# Altium schematic sheet ReadCard.SchDoc
size A4
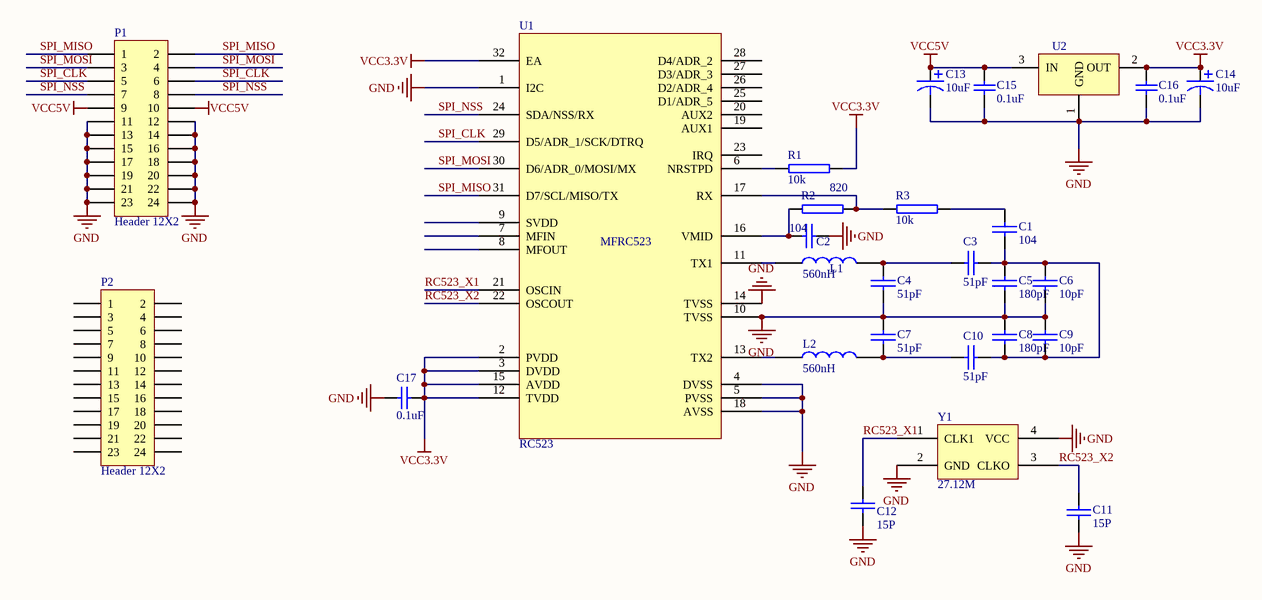
[diagram p0: ReadCard.SchDoc]

## Parts
C1  104  [0603C]
C2  104  [0603C]
C3  51pF  [0603C]
C4  51pF  [0603C]
C5  180pF  [0603C]
C6  10pF  [0603C]
C7  51pF  [0603C]
C8  180pF  [0603C]
C9  10pF  [0603C]
C10  51pF  [0603C]
C11  15P  [0603c]
C12  15P  [0603C]
C13  10uF  [1206_C]
C14  10uF  [1206_C]
C15  0.1uF  [0603_C]
C16  0.1uF  [0603_C]
C17  0.1uF  [0603_C]
L1  560nH  [0805r]
L2  560nH  [0805r]
P1  Header 12X2  [12x2_2.0mm]
P2  Header 12X2  [12x2_2.0mm]
R1  10k  [0603R]
R2  820  [0603R]
R3  10k  [0603R]
U1  RC523  [rc522]
U2  LM1117  [SOT-223]  (value not drawn)
Y1  27.12M  [27.12M_3225]

## Nets
GND: C2.1 C4.2 C5.2 C6.2 C7.1 C8.1 C9.1 C11.1 C12.1 C13.2 C14.2 C15.2 C16.2 C17.1 P1.11 P1.12 P1.13 P1.14 P1.15 P1.16 P1.17 P1.18 P1.19 P1.20 P1.21 P1.22 P1.23 P1.24 U1.1(I2C) U1.4(DVSS) U1.5(PVSS) U1.10(TVSS) U1.14(TVSS) U1.18(AVSS) U2.1(GND) Y1.2(GND) Y1.4(VCC)
VCC3.3V: C14.1 C16.1 C17.2 R1.2 U1.2(PVDD) U1.3(DVDD) U1.12(TVDD) U1.15(AVDD) U1.32(EA) U2.2(OUT)
VCC5V: C13.1 C15.1 P1.9 P1.10 U2.3(IN)
RC523_X1: C12.2 U1.21(OSCIN) Y1.1(CLK1)
RC523_X2: C11.2 U1.22(OSCOUT) Y1.3(CLKO)
SPI_CLK: P1.5 P1.6 U1.29(D5/ADR_1/SCK/DTRQ)
SPI_MISO: P1.1 P1.2 U1.31(D7/SCL/MISO/TX)
SPI_MOSI: P1.3 P1.4 U1.30(D6/ADR_0/MOSI/MX)
SPI_NSS: P1.7 P1.8 U1.24(SDA/NSS/RX)
NetC1_1: C1.1 R3.1
NetC1_2: C1.2 C3.2 C5.1 C6.1 C8.2 C9.2 C10.2
NetC2_2: C2.2 R2.2 U1.16(VMID)
NetC3_1: C3.1 C4.1 L1.2
NetC7_2: C7.2 C10.1 L2.2
NetL1_1: L1.1 U1.11(TX1)
NetL2_1: L2.1 U1.13(TX2)
NetR1_1: R1.1 U1.6(NRSTPD)
NetR2_1: R2.1 R3.2 U1.17(RX)

Not connected (* = marked no-connect by the designer): P2 1 2 3 4 5 6 7 8 9 10 11 12 13 14 15 16 17 18 19 20 21 22 23 24; U1 7(MFIN) 8(MFOUT) 9(SVDD) 19(AUX1) 20(AUX2) 23(IRQ) 25(D1/ADR_5) 26(D2/ADR_4) 27(D3/ADR_3) 28(D4/ADR_2)

## Notes on the sheet
- (in symbol RC523) MFRC523

## Library data of the parts
C1-C12 = CAP: Capacitor
C13 C14 = CAPACITOR: 贴片电容，1206
C15-C17 = Cap: 贴片电容，0603
L1 L2 = INDUCTOR1
P1 P2 = Header 12X2: Header, 12-Pin, Dual row, 2.0mm
R1-R3 = RES2
Y1 = XTAL